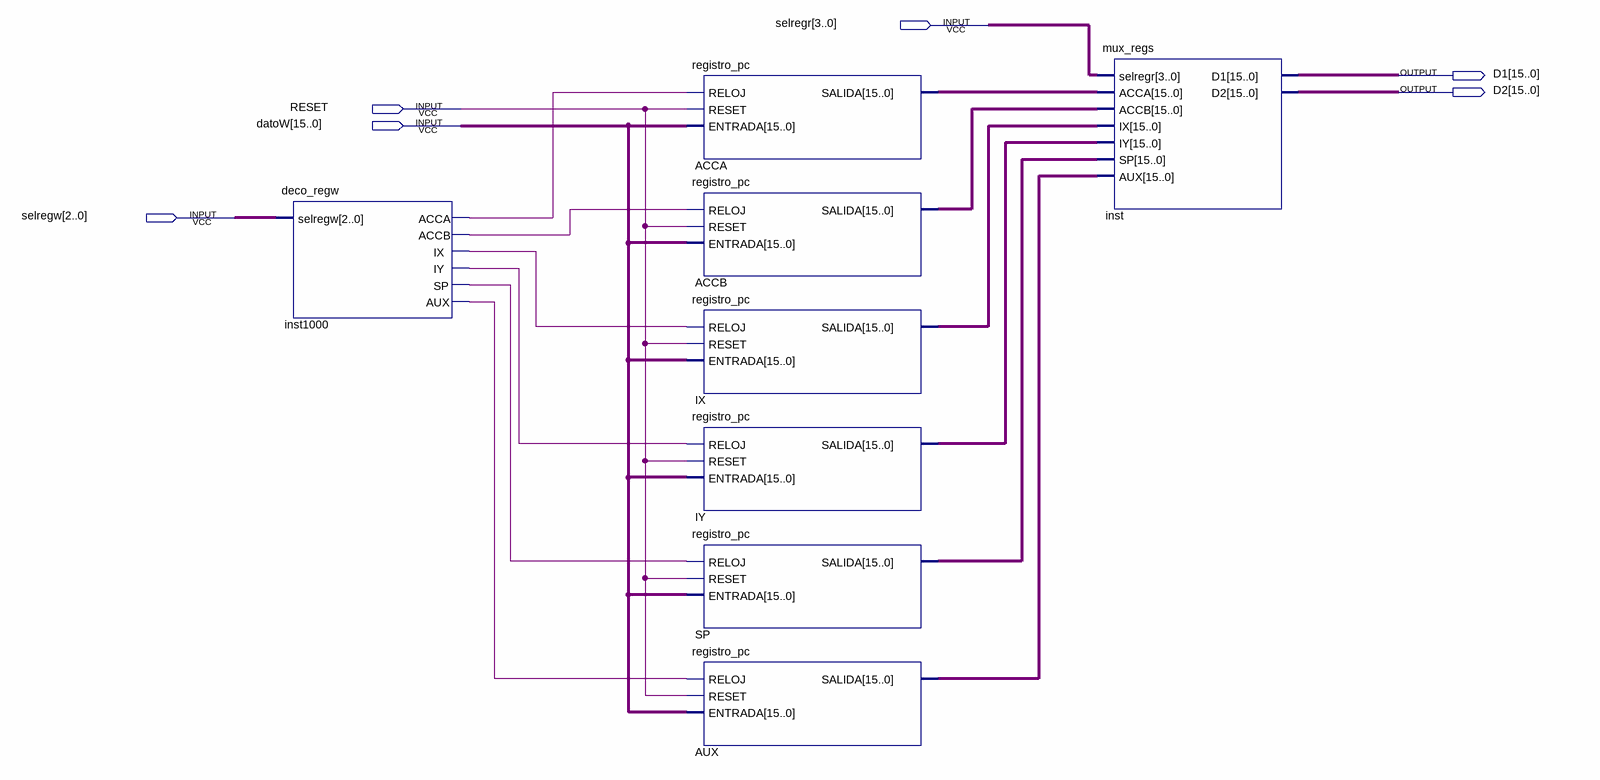
[diagram p0: schematic sheet]
// Quartus schematic registros.bdf as structural Verilog: 8 symbols, 6 pins
module registros (
  input  [3:0] selregr,
  input  RESET,
  input  [15:0] datoW,
  input  [2:0] selregw,
  output [15:0] D1,
  output [15:0] D2
);

  wire inst1000_acca, inst1000_accb, inst1000_aux, inst1000_ix, inst1000_iy, inst1000_sp;
  wire [15:0] ACCA_salida, ACCB_salida, AUX_salida, IX_salida, IY_salida, SP_salida;

  deco_regw inst1000 (
    .selregw(selregw), .ACCA(inst1000_acca), .ACCB(inst1000_accb), .IX(inst1000_ix), .IY(inst1000_iy),
    .SP(inst1000_sp), .AUX(inst1000_aux));
  registro_pc ACCA (.RELOJ(inst1000_acca), .RESET(RESET), .ENTRADA(datoW), .SALIDA(ACCA_salida));
  registro_pc ACCB (.RELOJ(inst1000_accb), .RESET(RESET), .ENTRADA(datoW), .SALIDA(ACCB_salida));
  registro_pc IX (.RELOJ(inst1000_ix), .RESET(RESET), .ENTRADA(datoW), .SALIDA(IX_salida));
  registro_pc IY (.RELOJ(inst1000_iy), .RESET(RESET), .ENTRADA(datoW), .SALIDA(IY_salida));
  registro_pc SP (.RELOJ(inst1000_sp), .RESET(RESET), .ENTRADA(datoW), .SALIDA(SP_salida));
  registro_pc AUX (.RELOJ(inst1000_aux), .RESET(RESET), .ENTRADA(datoW), .SALIDA(AUX_salida));
  mux_regs inst (
    .selregr(selregr), .ACCA(ACCA_salida), .ACCB(ACCB_salida), .IX(IX_salida), .IY(IY_salida),
    .SP(SP_salida), .AUX(AUX_salida), .D1(D1), .D2(D2));
endmodule
